# Altium schematic sheet HMC1001_FreeSize_V1_0.SchDoc
size A1
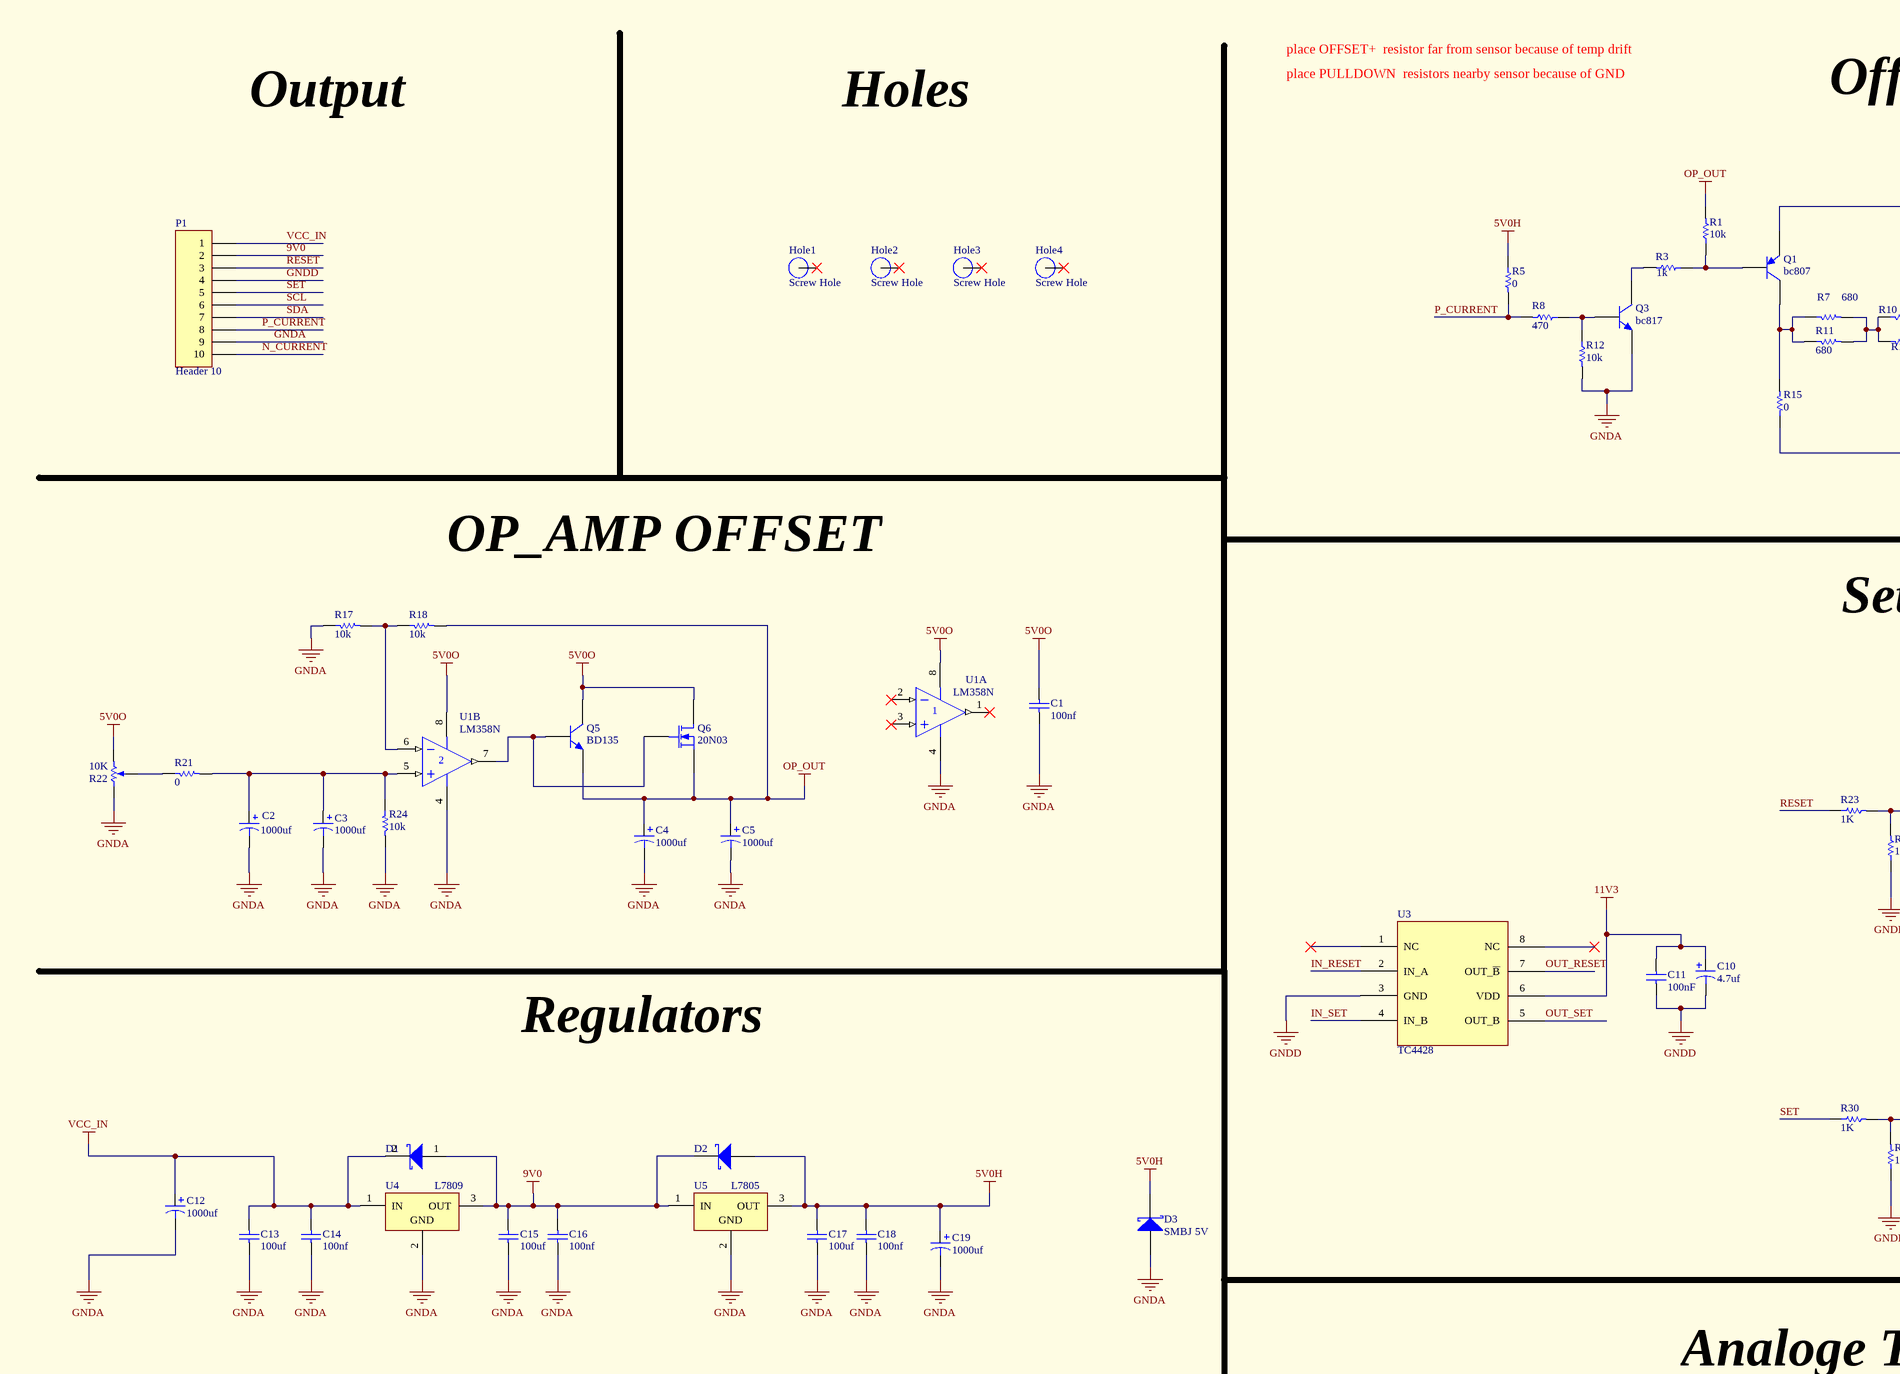
[diagram p0: HMC1001_FreeSize_V1_0.SchDoc, top left]
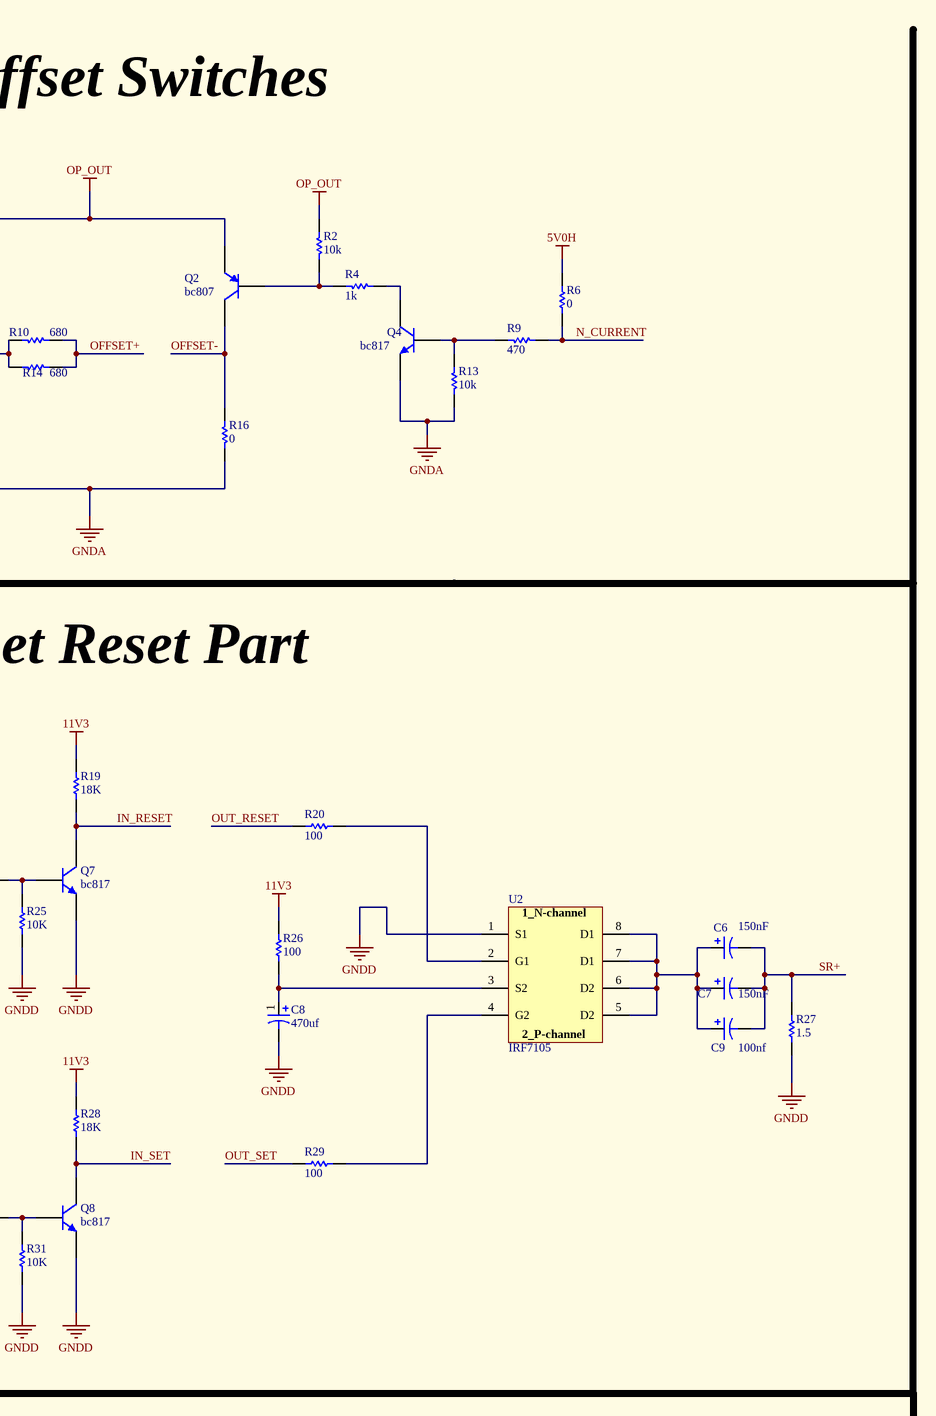
[diagram p1: HMC1001_FreeSize_V1_0.SchDoc, top right]
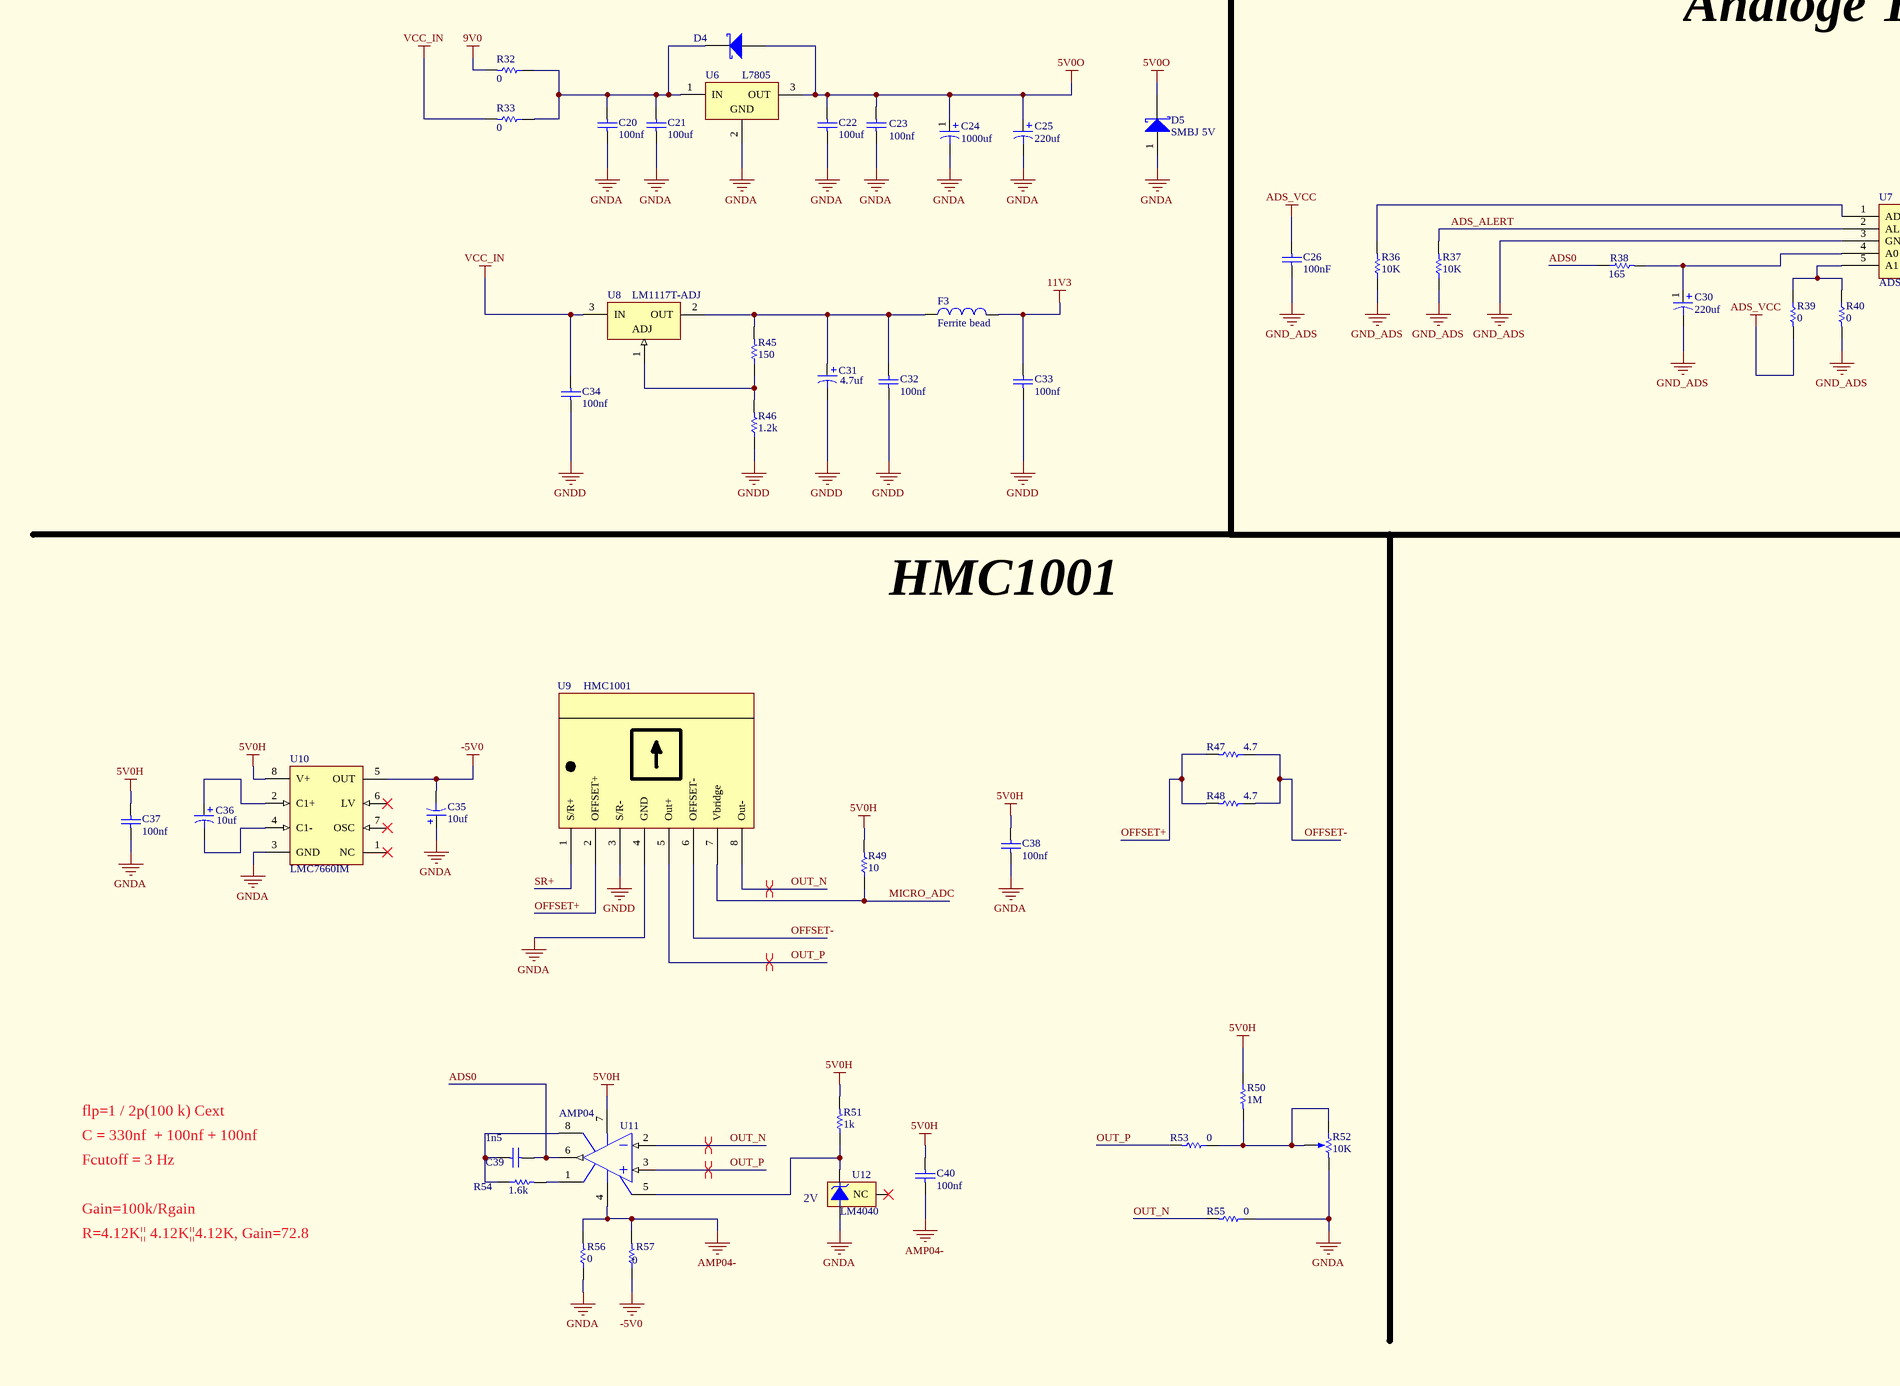
[diagram p2: HMC1001_FreeSize_V1_0.SchDoc, bottom left]
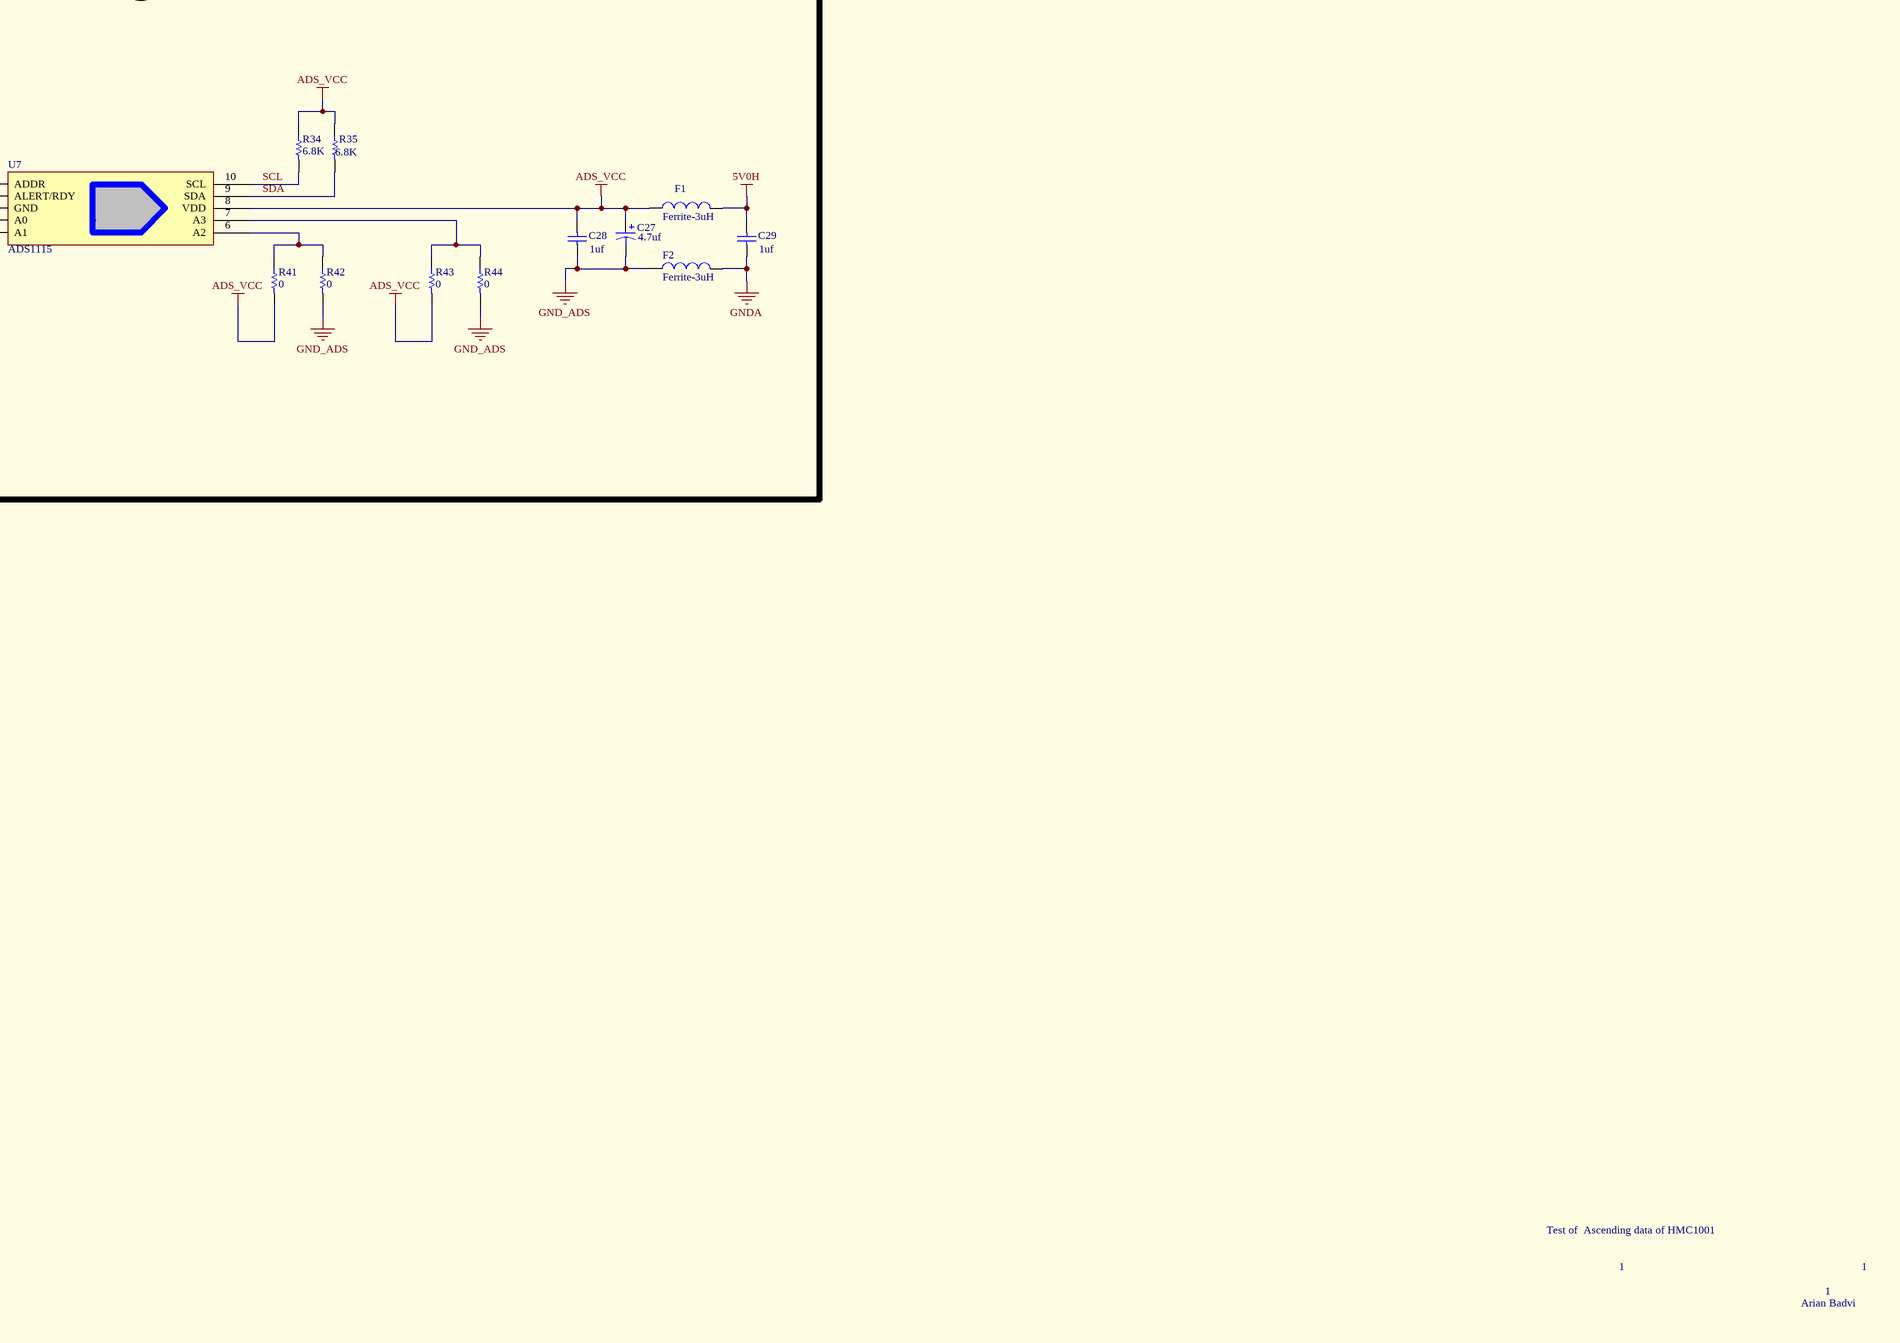
[diagram p3: HMC1001_FreeSize_V1_0.SchDoc, bottom right]

## Parts
C1  100nf  [C_1206]
C2  1000uf  [C_EL_10_10]
C3  1000uf  [C_EL_10_10]
C4  1000uf  [C_EL_10_10]
C5  1000uf  [C_EL_10_10]
C6  150nF  [cap_smd_a]
C7  150nF  [cap_smd_a]
C8  470uf  [cap_smd_d]
C9  100nf  [cap_smd_a]
C10  4.7uf  [cap_smd_a]
C11  100nF  [C_1206]
C12  1000uf  [C_EL_10_10]
C13  100uf  [C_1206]
C14  100nf  [C_1206]
C15  100uf  [C_1206]
C16  100nf  [C_1206]
C17  100uf  [C_1206]
C18  100nf  [C_1206]
C19  1000uf  [C_EL_10_10]
C20  100nf  [C_1206]
C21  100uf  [C_1206]
C22  100uf  [C_1206]
C23  100nf  [C_1206]
C24  1000uf  [C_EL_10_10]
C25  220uf  [C_EL_6_6]
C26  100nF  [C_1206]
C27  4.7uf  [CAP_SMD_A]
C28  1uf  [C_1206]
C29  1uf  [C_1206]
C30  220uf  [cap_smd_d]
C31  4.7uf  [cap_smd_a]
C32  100nf  [C_1206]
C33  100nf  [C_1206]
C34  100nf  [C_1206]
C35  10uf  [cap_smd_a]
C36  10uf  [cap_smd_a]
C37  100nf  [C_1206]
C38  100nf  [C_1206]
C39  1n5  [C_1206]
C40  100nf  [C_1206]
D1  D Schottky  [ZENER]  (value not drawn)
D2  D Schottky  [ZENER]  (value not drawn)
D3  SMBJ 5V  [TVS]
D4  D Schottky  [ZENER]  (value not drawn)
D5  SMBJ 5V  [TVS]
F1  Ferrite-3uH  [1206]
F2  Ferrite-3uH  [1206]
F3  Ferrite bead  [1206]
Hole1  Screw Hole  [HOLE_3mm_5mm]  (no BOM)
Hole2  Screw Hole  [HOLE_3mm_5mm]  (no BOM)
Hole3  Screw Hole  [HOLE_3mm_5mm]  (no BOM)
Hole4  Screw Hole  [HOLE_3mm_5mm]  (no BOM)
P1  Header 10  [HDR_F_1X10]
Q1  bc807  [sot-23]
Q2  bc807  [sot-23]
Q3  bc817  [sot-23]
Q4  bc817  [sot-23]
Q5  BD135  [sot-32]
Q6  20N03  [dpak]
Q7  bc817  [sot-23]
Q8  bc817  [sot-23]
R1  10k  [1206]
R2  10k  [1206]
R3  1k  [1206]
R4  1k  [1206]
R5  0  [1206]
R6  0  [1206]
R7  680  [R2W_AX_VER]
R8  470  [1206]
R9  470  [1206]
R10  680  [R2W_AX_VER]
R11  680  [R2W_AX_VER]
R12  10k  [1206]
R13  10k  [1206]
R14  680  [R2W_AX_VER]
R15  0  [0603]
R16  0  [0603]
R17  10k  [1206]
R18  10k  [1206]
R19  18K  [1206]
R20  100  [0603]
R21  0  [1206]
R22  value 10K  [POT_3296w]  (hidden comment: RPot)
R23  1K  [1206]
R24  10k  [1206]
R25  10K  [1206]
R26  100  [1206]
R27  1.5  [1206]
R28  18K  [1206]
R29  100  [0603]
R30  1K  [1206]
R31  10K  [1206]
R32  0  [0603]
R33  0  [0603]
R34  6.8K  [1206]
R35  6.8K  [1206]
R36  10K  [1206]
R37  10K  [1206]
R38  165  [1206]
R39  0  [1206]
R40  0  [1206]
R41  0  [1206]
R42  0  [1206]
R43  0  [1206]
R44  0  [1206]
R45  150  [1206]
R46  1.2k  [1206]
R47  4.7  [R025W_AX04]
R48  4.7  [R025W_AX04]
R49  10  [1206]
R50  1M  [R025W_AX04]
R51  1k  [1206]
R52  value 10K  [POT_3296w]  (hidden comment: RPot)
R53  0  [0603]
R54  1.6k  [1206]
R55  0  [0603]
R56  0  [0603]
R57  0  [0603]
U1  LM358N  [sop8]  (parts A,B of 2)
U2  IRF7105  [sop8]
U3  TC4428  [sop8]
U4  L7809  [TO220]
U5  L7805  [TO220]
U6  L7805  [TO220]
U7  ADS1115  [TSSOP10_N]
U8  LM1117T-ADJ  [DPAK]
U9  HMC1001  [HMC1001]
U10  LMC7660IM  [sop8]
U11  AMP04  [sop8]
U12  LM4040  [sot-23]

## Nets
5V0H: C17.2 C18.2 C19.1 C29.2 C37.2 C38.2 C40.2 D2.1(A) D3.2(K) F1.2 R5.1 R6.1 R49.2 R50.1 R51.2 U5.3(OUT) U10.8(V+) U11.7(V+)
5V0O: C1.2 C22.2 C23.2 C24.1 C25.1 D4.1(A) D5.2(K) Q5.2(C) Q6.2(D) R22.3(BOT) U1.8(V+) U6.3(OUT)
9V0: C15.2 C16.2 D1.1(A) D2.2(K) P1.2 R32.2 U4.3(OUT) U5.1(IN)
11V3: C10.1 C11.1 C33.2 F3.2 R19.2 R26.1 R28.2 U3.6(VDD)
-5V0: C35.2 R57.1 U10.5(OUT)
ADS_VCC: C26.2 C27.1 C28.2 F1.1 R34.1 R35.1 R39.2 R41.2 R43.2 U7.8(VDD)
AMP04-: C40.1 R56.2 R57.2 U11.4(V-)
GND_ADS: C26.1 C27.2 C28.1 C30.2 F2.1 R36.1 R37.1 R40.2 R42.2 R44.2 U7.3(GND)
GNDA: C1.1 C2.2 C3.2 C4.2 C5.2 C12.2 C13.1 C14.1 C15.1 C16.1 C17.1 C18.1 C19.2 C20.1 C21.1 C22.1 C23.1 C24.2 C25.2 C29.1 C35.1 C37.1 C38.1 D3.1(A) D5.1(A) F2.2 P1.9 Q3.2(E) Q4.2(E) R12.2 R13.2 R15.1 R16.1 R17.1 R22.1(TOP) R24.2 R52.3(BOT) R55.1 R56.1 U1.4(V-) U4.2(GND) U5.2(GND) U6.2(GND) U9.4(GND) U10.3(GND) U12.2(-V)
GNDD: C8.2 C10.2 C11.2 C31.2 C32.1 C33.1 C34.1 P1.4 Q7.2(E) Q8.2(E) R25.1 R27.2 R31.1 R46.1 U2.1(S1) U3.3(GND) U9.3(S/R-)
OP_OUT: C4.1 C5.1 Q1.2(E) Q2.2(E) Q5.3(E) Q6.3(S) R1.2 R2.2 R18.2
VCC_IN: C12.1 C13.2 C14.2 C34.2 D1.2(K) P1.1 R33.2 U4.1(IN) U8.3(IN)
ADS0: C39.1 R38.1 U11.6(OUT)
ADS_ALERT: R37.2 U7.2(ALERT/RDY)
IN_RESET: Q7.3(C) R19.1 U3.2(IN_A)
IN_SET: Q8.3(C) R28.1 U3.4(IN_B)
MICRO_ADC: R49.1 U9.7(Vbridge)
N_CURRENT: P1.10 R6.2 R9.2
OFFSET+: R10.2 R14.2 R47.2 R48.2 U9.2(OFFSET+)
OFFSET-: Q2.3(C) R16.2 R47.1 R48.1 U9.6(OFFSET-)
OUT_N: R55.2 U9.8(Out-) U11.2(IN-)
OUT_P: R53.2 U9.5(Out+) U11.3(IN+)
OUT_RESET: R20.2 U3.7(OUT_~{B})
OUT_SET: R29.2 U3.5(OUT_B)
P_CURRENT: P1.8 R5.2 R8.2
RESET: P1.3 R23.1
SCL: P1.6 R34.2 U7.10(SCL)
SDA: P1.7 R35.2 U7.9(SDA)
SET: P1.5 R30.1
SR+: C6.2 C7.2 C9.2 R27.1 U9.1(S/R+)
NetC2_1: C2.1 C3.1 R21.2 R24.1 U1.5(IN+)
NetC6_1: C6.1 C7.1 C9.1 U2.5(D2) U2.6(D2) U2.7(D1) U2.8(D1)
NetC8_1: C8.1 R26.2 U2.3(S2)
NetC20_2: C20.2 C21.2 D4.2(K) R32.1 R33.1 U6.1(IN)
NetC30_1: C30.1 R38.2 U7.4(A0)
NetC31_1: C31.1 C32.2 F3.1 R45.2 U8.2(OUT)
NetC36_1: C36.1 U10.2(C1+)
NetC36_2: C36.2 U10.4(C1-)
NetC39_2: C39.2 R54.1 U11.8(TAB)
NetQ1_1: Q1.1(B) R1.1 R3.1
NetQ1_3: Q1.3(C) R7.1 R11.1 R15.2
NetQ2_1: Q2.1(B) R2.1 R4.1
NetQ3_1: Q3.1(B) R8.1 R12.1
NetQ3_3: Q3.3(C) R3.2
NetQ4_1: Q4.1(B) R9.1 R13.1
NetQ4_3: Q4.3(C) R4.2
NetQ5_1: Q5.1(B) Q6.1(G) U1.7(OUT)
NetQ7_1: Q7.1(B) R23.2 R25.2
NetQ8_1: Q8.1(B) R30.2 R31.2
NetR7_2: R7.2 R10.1 R11.2 R14.1
NetR17_2: R17.2 R18.1 U1.6(IN-)
NetR20_1: R20.1 U2.2(G1)
NetR21_1: R21.1 R22.2(TAP)
NetR29_1: R29.1 U2.4(G2)
NetR36_2: R36.2 U7.1(ADDR)
NetR39_1: R39.1 R40.1 U7.5(A1)
NetR41_1: R41.1 R42.1 U7.6(A2)
NetR43_1: R43.1 R44.1 U7.7(A3)
NetR45_1: R45.1 R46.2 U8.1(ADJ)
NetR50_2: R50.2 R52.1(TOP) R52.2(TAP) R53.1
NetR51_1: R51.1 U11.5(OS_NUL) U12.1(+V)
NetR54_2: R54.2 U11.1(OS_NUL)

Not connected (* = marked no-connect by the designer): Hole1 1*; Hole2 1*; Hole3 1*; Hole4 1*; U1 1(OUT)* 2(IN-)* 3(IN+)*; U3 1(NC)* 8(NC)*; U10 1(NC)* 6(LV)* 7(OSC)*; U12 3(NC)*

## Layout directives
differential pair: OUT_N, OUT_P

## Notes on the sheet
- place OFFSET+  resistor far from sensor because of temp drift
- Output
- Holes
- place PULLDOWN  resistors nearby sensor because of GND
- Offset Switches
- OP_AMP OFFSET
- Set Reset Part
- Regulators
- Analoge To Digital Converter
- HMC1001
- flp=1 / 2p(100 k) Cext
- C = 330nf  + 100nf + 100nf
- Fcutoff = 3 Hz
- Gain=100k/Rgain
- (near U12) 2V
- R=4.12K|| 4.12K||4.12K, Gain=72.8
- Test of  Ascending data of HMC1001
- 1
- Arian Badvi
- (in symbol IRF7106) 1_N-channel; 2_P-channel

## Library data of the parts
C1 C11 C26 C32-C34 C37-C40 = Cap: Capacitor; Published: 8-Jun-2000; LatestRevisionDate: 17-Jul-2002; LatestRevisionNote: Re-released for DXP Platform.; PackageReference: RAD-0.3; Publisher: Altium Limited
  C1 C32-C34 C37 C38 C40: PackageDescription: Radial Cap, Thru-Hole; 2 Leads; 0.3 in Pin Spacing; Value: 100nf
  C11: PackageDescription: Radial Cap, Thru-Hole; 2 Leads; 0.3 in Pin Spacing; Value: 100nF
  C26: Value: 100nF
  C39: PackageDescription: Radial Cap, Thru-Hole; 2 Leads; 0.3 in Pin Spacing; Value: 1n5
C2-C5 C25 = Cap Pol1: electrolytic smd cap 16V; Published: 8-Jun-2000; LatestRevisionDate: 17-Jul-2002; LatestRevisionNote: Re-released for DXP Platform.; PackageReference: RB7.6-15; Publisher: Altium Limited; PackageDescription: Polarized Capacitor (Radial); 2 Leads
  C2-C5: Value: 1000uf
  C25: Value: 220uf
C6 C7 C9 C10 C31 C35 C36 = Cap Pol1: Polarized Capacitor (Radial); Published: 8-Jun-2000; LatestRevisionDate: 17-Jul-2002; LatestRevisionNote: Re-released for DXP Platform.; PackageReference: RB7.6-15; Publisher: Altium Limited; PackageDescription: Polarized Capacitor (Radial); 2 Leads
  C6 C7: Value: 150nF
  C9: Value: 100nf
  C10 C31: Value: 4.7uf
  C35 C36: Value: 10uf
C8 C30 = Cap Pol1: TAN CAP D SIZE; Published: 8-Jun-2000; LatestRevisionDate: 17-Jul-2002; LatestRevisionNote: Re-released for DXP Platform.; PackageReference: RB7.6-15; Publisher: Altium Limited; PackageDescription: Polarized Capacitor (Radial); 2 Leads
  C8: Value: 470uf
  C30: Value: 220uf
C12 C19 C24 = Cap Pol1: electrolytic smd cap; Published: 8-Jun-2000; LatestRevisionDate: 17-Jul-2002; LatestRevisionNote: Re-released for DXP Platform.; PackageReference: RB7.6-15; Publisher: Altium Limited; PackageDescription: Polarized Capacitor (Radial); 2 Leads; Value: 1000uf
C13-C18 C20-C23 C28 C29 = Cap: Capacitor, 1206; Published: 8-Jun-2000; LatestRevisionDate: 17-Jul-2002; LatestRevisionNote: Re-released for DXP Platform.; PackageReference: RAD-0.3; Publisher: Altium Limited
  C13 C15 C17 C21 C22: Value: 100uf
  C14 C16 C18 C20 C23: Value: 100nf
  C28 C29: PackageDescription: Radial Cap, Thru-Hole; 2 Leads; 0.3 in Pin Spacing; Value: 1uf
C27 = Cap Pol: Tantalium Capacitor; Published: 8-Jun-2000; LatestRevisionDate: 17-Jul-2002; LatestRevisionNote: Re-released for DXP Platform.; PackageReference: POLAR0.8; Publisher: Altium Limited; PackageDescription: Polarized Capacitor; 2 Leads; Value: 4.7uf
D1 D2 D4 = D Schottky: Schottky Diode, 1N4148; Published: 8-Jun-2000; LatestRevisionDate: 17-Jul-2002; LatestRevisionNote: Re-released for DXP Platform.; PackageReference: SMB; Publisher: Altium Limited; Code_JEDEC: DO-214-AA
D3 D5 = Diode 18TQ045: Schottky Rectifier; Note: Terminal 2 is the TAB and is electrically connected to the cathode; Published: 8-Jun-2000; LatestRevisionDate: 17-Jul-2002; LatestRevisionNote: Re-released for DXP Platform.; DatasheetVersion: Dec-1997; PackageVersion: Feb-1998; PackageReference: TO-220AC; Publisher: Altium Limited; ComponentLink1Description: Manufacturer Link; ComponentLink1URL: http://www.irf.com/; ComponentLink2Description: Datasheet; ComponentLink2URL: http://www.irf.com/product-info/datasheets/data/18tq.pdf
F1 F2 = Inductor: Code_IEC: 1005; Published: 8-Jun-2000; LatestRevisionDate: 29-May-2009; LatestRevisionNote: IPC-7351 Footprint Added.; PackageReference: 0402-A; Publisher: Altium Limited; PackageDescription: Chip Inductor; Code_JEITA: 0402
F3 = Inductor: Ferrite bead, 1206; Code_IEC: 1005; Value: 10mH; Published: 8-Jun-2000; LatestRevisionDate: 29-May-2009; LatestRevisionNote: IPC-7351 Footprint Added.; PackageReference: 0402-A; Publisher: Altium Limited; PackageDescription: Chip Inductor; Code_JEITA: 0402
P1 = Header 10: Header, 10-Pin; LatestRevisionDate: 17-Jul-2002; LatestRevisionNote: Re-released for DXP Platform.; Publisher: Altium Limited
Q1 Q2 = 2N3906: PNP General Purpose Amplifier; Published: 8-Jun-2000; LatestRevisionDate: 15-Jan-2003; LatestRevisionNote: PCB Footprint 'BCY-W3/D4.7' replaced; DatasheetVersion: 1997; PackageVersion: Sep-1998; PackageReference: TO-92A; Publisher: Altium Limited; Code_JEDEC: TO-92A; ComponentLink1Description: Manufacturer Link; ComponentLink1URL: http://www.fairchildsemi.com/; ComponentLink2Description: Datasheet; ComponentLink2URL: http://www.fairchildsemi.com/ds/2N%2F2N3906.pdf
Q3-Q5 Q7 Q8 = 2N3904: NPN General Purpose Amplifier; Published: 8-Jun-2000; LatestRevisionDate: 15-Jan-2003; LatestRevisionNote: PCB Footprint 'BCY-W3/D4.7' replaced; DatasheetVersion: 1997; PackageVersion: Sep-1998; PackageReference: TO-92A; Publisher: Altium Limited; ComponentLink1Description: Manufacturer Link; ComponentLink1URL: http://www.fairchildsemi.com/; ComponentLink2Description: Datasheet; ComponentLink2URL: http://www.fairchildsemi.com/ds/2N%2F2N3904.pdf
  Q3-Q5: Code_JEDEC: TO-92A
  Q7 Q8: PackageDescription: TO, Flat Index; 3 In-Line, Axial Leads; Body Dia. 4.5mm; Leads 0.51 x 0.48 mm (max)
Q6 = MOSFET-N: N-Channel MOSFET; Published: 8-Jun-2000; LatestRevisionDate: 17-Jul-2002; LatestRevisionNote: Re-released for DXP Platform.; PackageVersion: 1995/1996; PackageReference: E3; Publisher: Altium Limited
R1-R21 R23-R31 = Res1: Resistor; Published: 8-Jun-2000; LatestRevisionDate: 17-Jul-2002; LatestRevisionNote: Re-released for DXP Platform.; PackageReference: AXIAL-0.3; Publisher: Altium Limited; PackageDescription: Axial Device, Thru-Hole; 2 Leads; 0.3 in Pin Spacing
  R1 R2 R12 R13 R17 R18 R24: Value: 10k
  R3 R4: Value: 1k
  R5 R6 R15 R16 R21: Value: 0
  R7 R10 R11 R14: Value: 680
  R8 R9: Value: 470
  R19 R28: Value: 18K
  R20 R26 R29: Value: 100
  R23 R30: Value: 1K
  R25 R31: Value: 10K
  R27: Value: 1.5
R22 R52 = RPot: Potentiometer; Sim Note: Enter the Resistance value and the set point into parameter fields.; Set Position: 0.5; Published: 8-Jun-2000; LatestRevisionDate: 17-Jul-2002; LatestRevisionNote: Re-released for DXP Platform.; PackageReference: VR5; Publisher: Altium Limited
R32 R33 R45-R51 R53 R55-R57 = Resistor: Email: razi.vesali@gmail.com; Published: 17-Jun-2016; LatestRevisionNote: Re-released for puplic; Publisher: Seyed Razi Vesali
  R32 R33 R53 R55-R57: Value: 0
  R45: Value: 150
  R46: Value: 1.2k
  R47 R48: Value: 4.7
  R49: Value: 10
  R50: Value: 1M
  R51: Value: 1k
R34-R44 R54 = Resistor: General Resistor; Published: 8-Jun-2000; LatestRevisionDate: 17-Jul-2002; LatestRevisionNote: Re-released for DXP Platform.; PackageReference: AXIAL-0.3; Publisher: Altium Limited; PackageDescription: Axial Device, Thru-Hole; 2 Leads; 0.3 in Pin Spacing
  R34 R35: Value: 6.8K
  R36 R37: Value: 10K
  R38: Value: 165
  R39-R44: Value: 0
  R54: Value: 1.6k
U1 = LM358N: Dual Low-Power Operational Amplifier; Published: 17-Jul-2002; LatestRevisionDate: 06-Jun-2005; LatestRevisionNote: Stylized 3D Model Added.; DatasheetVersion: 1988; PackageReference: 626-05; Publisher: Altium Limited; PackageDescription: DIP; 8 Leads; Row Spacing 7.62 mm; Pitch 2.54 mm; ComponentLink1Description: Manufacturer Link; ComponentLink1URL: http://www.onsemi.com/site/products/parametrics/0,4446,251,00.html; ComponentLink2Description: Datasheet; ComponentLink2URL: http://www.onsemi.com/pub/Collateral/LM358-D.PDF
U2 = IRF7106
U4-U6 = L7805CD2T: Positive Voltage Regulator; Published: 24-Aug-2001; LatestRevisionDate: 17-Jul-2002; LatestRevisionNote: Re-released for DXP Platform.; DatasheetVersion: Dec-1998; PackageReference: TO-263; Publisher: Altium Limited; PackageDescription: D2-PAK/TO-263-AB; 3 Leads (1 Cropped); Body 15.9 (inc. leads) x 10.4 mm (LxW max); ComponentLink1Description: Manufacturer Link; ComponentLink1URL: http://www.st.com/
U8 = LM1117T-ADJ: 800mA Low-Dropout Linear Regulator; Manufacturer: National Semiconductor; CompType: LDO IC; PackageTopMarking: NSUZXYTTE#*LM1117T*ADJ; PowerWise: N; Published: 4-Dec-2008; DatasheetVersion: Apr-2006; PackageVersion: revL, Jan-1992; PackageReference: T03B; Publisher: Altium Limited; PackageDescription: TO-220, Molded, 3 Lead, Straight; PartNumber: LM1117T-ADJ; RoHS: O; PinCount: 3; DigiKeyPartNumber: LM1117T-ADJ-ND; ComponentLink1Description: LM1117 Datasheet; ComponentLink1URL: http://www.national.com/ds/LM/LM1117.pdf; ComponentLink2Description: LM1117 Web Page; ComponentLink2URL: http://www.national.com/pf/LM/LM1117.html; ComponentLink3Description: T03B Package Page; ComponentLink3URL: http://www.national.com/packaging/folders/t03b.html
U10 = LMC7660IM: Switched Capacitor Voltage Converter; Manufacturer: National Semiconductor; CompType: Switch Caps; PackageTopMarking: NSZXTT*LMC76*60IM; PowerWise: N; Published: 4-Dec-2008; DatasheetVersion: Feb-2005; PackageVersion: revL, Sep-2006; PackageReference: M08A; Publisher: Altium Limited; PackageDescription: SOIC Narrow, 4.9 x 3.9 x 1.45mm, 8 Lead, 1.27mm Pitch; PartNumber: LMC7660IM; RoHS: O; PinCount: 8; DigiKeyPartNumber: LMC7660IM-ND; Code_JEDEC: MS-012-AA; Code_IPC: SOIC127P600-8; ComponentLink1Description: LMC7660 Datasheet; ComponentLink1URL: http://www.national.com/ds/LM/LMC7660.pdf; ComponentLink2Description: LMC7660 Web Page; ComponentLink2URL: http://www.national.com/pf/LM/LMC7660.html; ComponentLink3Description: M08A Package Page; ComponentLink3URL: http://www.national.com/packaging/folders/m08a.html
U11 = Op Amp: Published: 8-Jun-2000; LatestRevisionDate: 17-Jul-2002; LatestRevisionNote: Re-released for DXP Platform.; DatasheetVersion: REV. B; PackageVersion: 1990; PackageReference: H-08A; Publisher: Altium Limited; PackageDescription: Can; 8 Leads; Pin Circle Dia. 5.08 mm; Lead Dia. 0.53 mm (max); ComponentLink1Description: Manufacturer Link; ComponentLink1URL: http://www.analog.com/
U12 = LM4040: Precision Micropower Shunt Voltage Reference, 3-pin SOT-23; PartNumber: LM4040DIM3-10.0; Manufacturer: National Semiconductor; PackageTopMarking: R0D*XTT; PowerWise: N; CompType: Voltage Reference IC; Published: 4-Dec-2008; DatasheetVersion: Apr-2005; PackageVersion: revB, Mar-2003; PackageReference: MF03A; Publisher: Altium Limited; PackageDescription: Molded SOT-23, .115 x .051 x .037in Body, 3 Lead, .075 in Pitch; RoHS: N; PinCount: 3; ComponentLink1Description: LM4040 Datasheet; ComponentLink1URL: http://www.national.com/ds/LM/LM4040.pdf; ComponentLink2Description: LM4040 Web Page; ComponentLink2URL: http://www.national.com/pf/LM/LM4040.html; ComponentLink3Description: MF03A Package Page; ComponentLink3URL: http://www.national.com/packaging/folders/mf03a.html